# Altium schematic sheet Sheet1.SchDoc
size A4
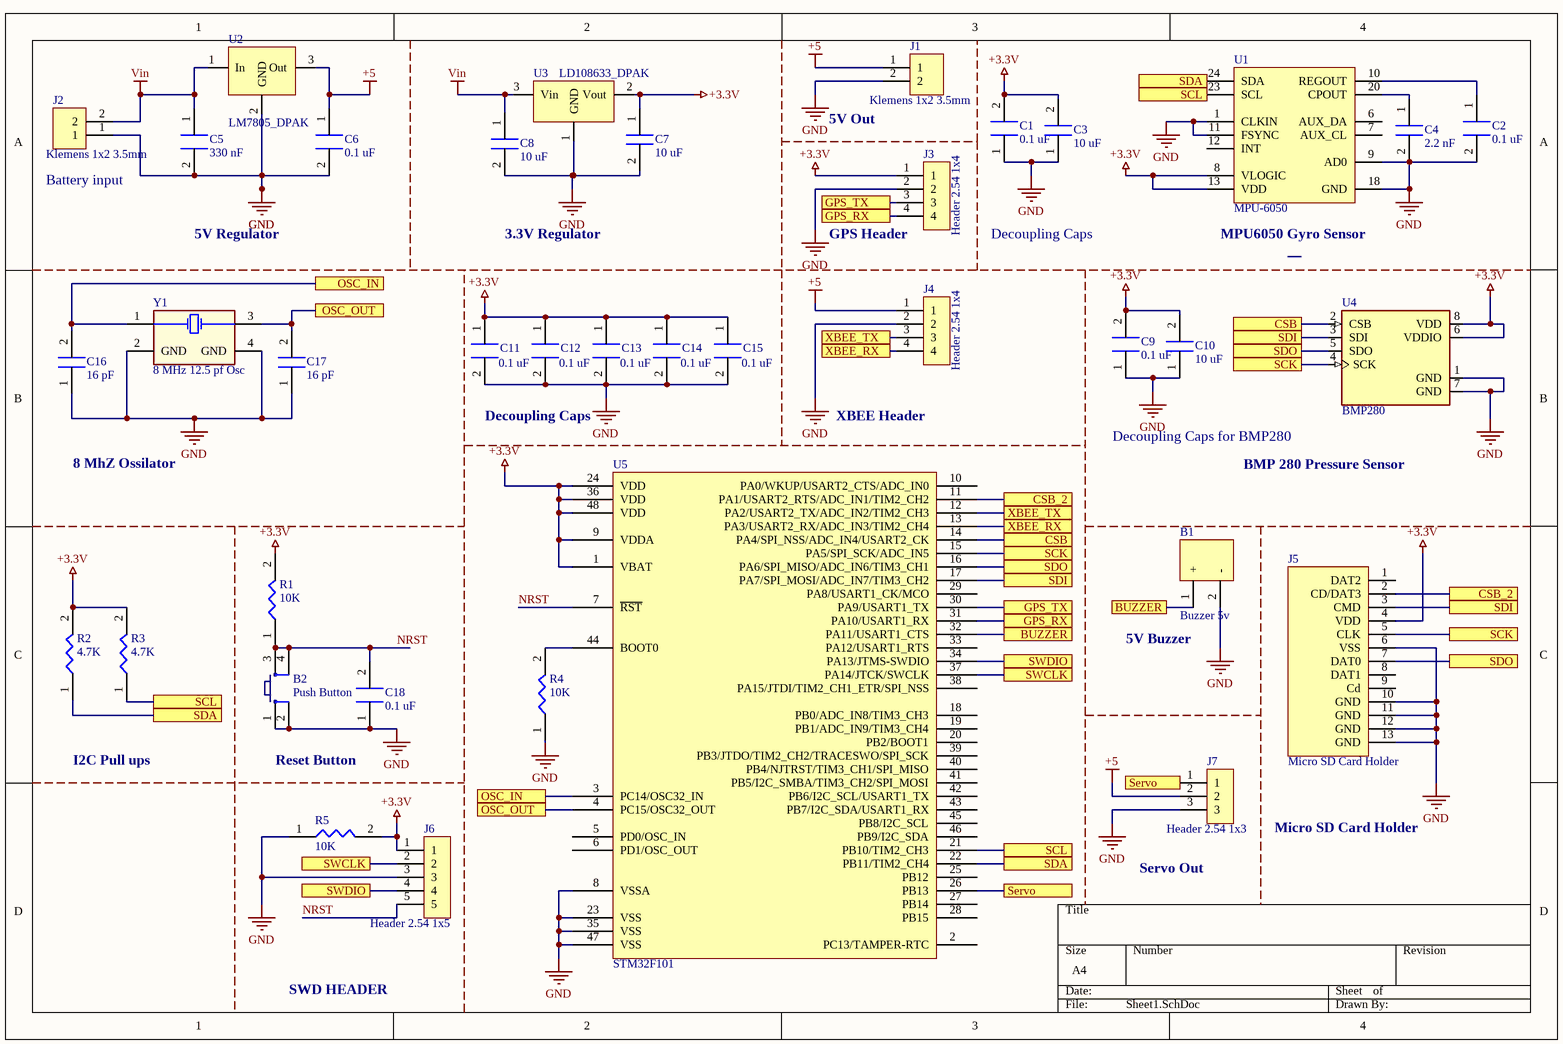
[diagram p0: Sheet1.SchDoc]

## Parts
B1  Buzzer 5v  [BUZZER_5V]
B2  Push Button  [PUSB BUTTON-SMD]
C1  0.1 uF  [C1206]
C2  0.1 uF  [C1206]
C3  10 uF  [C1206]
C4  2.2 nF  [C1206]
C5  330 nF  [C1206]
C6  0.1 uF  [C1206]
C7  10 uF  [C1206]
C8  10 uF  [C1206]
C9  0.1 uF  [C1206]
C10  10 uF  [C1206]
C11  0.1 uF  [C1206]
C12  0.1 uF  [C1206]
C13  0.1 uF  [C1206]
C14  0.1 uF  [C1206]
C15  0.1 uF  [C1206]
C16  16 pF  [C1206]
C17  16 pF  [C1206]
C18  0.1 uF  [C1206]
J1  Klemens 1x2 3.5mm  [Klemens 1x2 - 3.5mm]
J2  Klemens 1x2 3.5mm  [Klemens 1x2 - 3.5mm]
J3  Header 2.54 1x4  [Header 2.54 1x4]
J4  Header 2.54 1x4  [Header 2.54 1x4]
J5  Micro SD Card Holder  [Micro SD Card Holder]
J6  Header 2.54 1x5  [Header 2.54 1x5]
J7  Header 2.54 1x3  [Header 2.54 1x3]
R1  10K  [R1206 Resıstor]
R2  4.7K  [R1206 Resıstor]
R3  4.7K  [R1206 Resıstor]
R4  10K  [R1206 Resıstor]
R5  10K  [R1206 Resıstor]
U1  MPU-6050  [QFN50P400X400X90_HS-25N]
U2  LM7805_DPAK  [DPAK_3D]
U3  LD108633_DPAK  [DPAK_3D]
U4  BMP280  [BMP280]
U5  STM32F101  [LQFP48_stm32]
Y1  8 MHz 12.5 pf Osc  [8 MHZ Osc.]

## Ports
BUZZER, CSB, CSB_2, GPS_RX, GPS_TX, OSC_IN, OSC_OUT, SCK, SCL, SDA, SDI, SDO, Servo, SWCLK, SWDIO, XBEE_RX, XBEE_TX

## Nets
+3.3V: C1.2 C3.2 C7.1 C9.2 C10.2 C11.1 C12.1 C13.1 C14.1 C15.1 J3.1 J5.4(VDD) J6.1 R1.2 R2.2 R3.2 R5.2 U1.8(VLOGIC) U1.13(VDD) U3.2(Vout) U4.6(VDDIO) U4.8(VDD) U5.1(VBAT) U5.9(VDDA) U5.24(VDD) U5.36(VDD) U5.48(VDD)
+5: C6.1 J1.1 J4.1 J7.2 U2.3(Out)
GND: B1.2(-) B2.1 B2.2 C1.1 C2.2 C3.1 C4.2 C5.2 C6.2 C7.2 C8.2 C9.1 C10.1 C11.2 C12.2 C13.2 C14.2 C15.2 C16.1 C17.1 C18.1 J1.2 J2.1 J3.2 J4.2 J5.6(VSS) J5.10(GND) J5.11(GND) J5.12(GND) J5.13(GND) J6.3 J7.3 R4.1 R5.1 U1.1(CLKIN) U1.9(AD0) U1.11(FSYNC) U1.18(GND) U2.2(GND) U3.1(GND) U4.1(GND) U4.7(GND) U5.8(VSSA) U5.23(VSS) U5.35(VSS) U5.47(VSS) Y1.2(GND) Y1.4(GND)
Vin: C5.1 C8.1 J2.2 U2.1(In) U3.3(Vin)
BUZZER: B1.1(+) U5.32(PA11/USART1_CTS) ; port BUZZER
CSB: U4.2(CSB) U5.14(PA4/SPI_NSS/ADC_IN4/USART2_CK) ; port CSB
CSB_2: J5.2(CD/DAT3) U5.11(PA1/USART2_RTS/ADC_IN1/TIM2_CH2) ; port CSB_2
GPS_RX: J3.4 U5.31(PA10/USART1_RX) ; port GPS_RX
GPS_TX: J3.3 U5.30(PA9/USART1_TX) ; port GPS_TX
NRST: B2.3 B2.4 C18.2 J6.5 R1.1 U5.7(~{RST})
OSC_IN: C16.2 U5.3(PC14/OSC32_IN) Y1.1 ; port OSC_IN
OSC_OUT: C17.2 U5.4(PC15/OSC32_OUT) Y1.3 ; port OSC_OUT
SCK: J5.5(CLK) U4.4(SCK) U5.15(PA5/SPI_SCK/ADC_IN5) ; port SCK
SCL: R3.1 U1.23(SCL) U5.21(PB10/TIM2_CH3) ; port SCL
SDA: R2.1 U1.24(SDA) U5.22(PB11/TIM2_CH4) ; port SDA
SDI: J5.3(CMD) U4.3(SDI) U5.17(PA7/SPI_MOSI/ADC_IN7/TIM3_CH2) ; port SDI
SDO: J5.7(DAT0) U4.5(SDO) U5.16(PA6/SPI_MISO/ADC_IN6/TIM3_CH1) ; port SDO
Servo: J7.1 U5.26(PB13) ; port Servo
SWCLK: J6.2 U5.37(PA14/JTCK/SWCLK) ; port SWCLK
SWDIO: J6.4 U5.34(PA13/JTMS-SWDIO) ; port SWDIO
XBEE_RX: J4.4 U5.13(PA3/USART2_RX/ADC_IN3/TIM2_CH4) ; port XBEE_RX
XBEE_TX: J4.3 U5.12(PA2/USART2_TX/ADC_IN2/TIM2_CH3) ; port XBEE_TX
NetC2_1: C2.1 U1.10(REGOUT)
NetC4_1: C4.1 U1.20(CPOUT)
NetR4_2: R4.2 U5.44(BOOT0)

Not connected (* = marked no-connect by the designer): J5 1(DAT2) 8(DAT1) 9(Cd); U1 6(AUX_DA) 7(AUX_CL) 12(INT); U5 2(PC13/TAMPER-RTC) 5(PD0/OSC_IN) 6(PD1/OSC_OUT) 10(PA0/WKUP/USART2_CTS/ADC_IN0) 18(PB0/ADC_IN8/TIM3_CH3) 19(PB1/ADC_IN9/TIM3_CH4) 20(PB2/BOOT1) 25(PB12) 27(PB14) 28(PB15) 29(PA8/USART1_CK/MCO) 33(PA12/USART1_RTS) 38(PA15/JTDI/TIM2_CH1_ETR/SPI_NSS) 39(PB3/JTDO/TIM2_CH2/TRACESWO/SPI_SCK) 40(PB4/NJTRST/TIM3_CH1/SPI_MISO) 41(PB5/I2C_SMBA/TIM3_CH2/SPI_MOSI) 42(PB6/I2C_SCL/USART1_TX) 43(PB7/I2C_SDA/USART1_RX) 45(PB8/I2C_SCL) 46(PB9/I2C_SDA)

## Notes on the sheet
- 5V Out
- Battery input
- 5V Regulator
- 3.3V Regulator
- (near J3) GPS Header
- Decoupling Caps
- (near U1) MPU6050 Gyro Sensor
- XBEE Header
- Decoupling Caps for BMP280
- 8 MhZ Ossilator
- BMP 280 Pressure Sensor
- (near B1) 5V Buzzer
- I2C Pull ups
- Reset Button
- Micro SD Card Holder
- (near J7) Servo Out
- SWD HEADER

## Library data of the parts
B2 = Push Button: Smd Push Button; Satın Alma Linki: https://urun.n11.com/diger/mini-pushbutton-switch-smd-P227461537?gclid=Cj0KCQjwkoDmBRCcARIsAG3xzl8Y_-jeD7HocNM6lvuZ_rVp83568XPGtNzlPwXWLph8oCRqo0yh87UaApZYEALw_wcB&gclsrc=aw.ds
C1 C2 C6 C9 C11-C15 C18 = 0.1 uF C1206
C4 = 2.2 nF c1206
C5 = 330 nF C1206
R1 R4 R5 = 10K R1206
R2 R3 = 4.7K R1206